# Altium schematic sheet 传感器板2.SchDoc
size A3
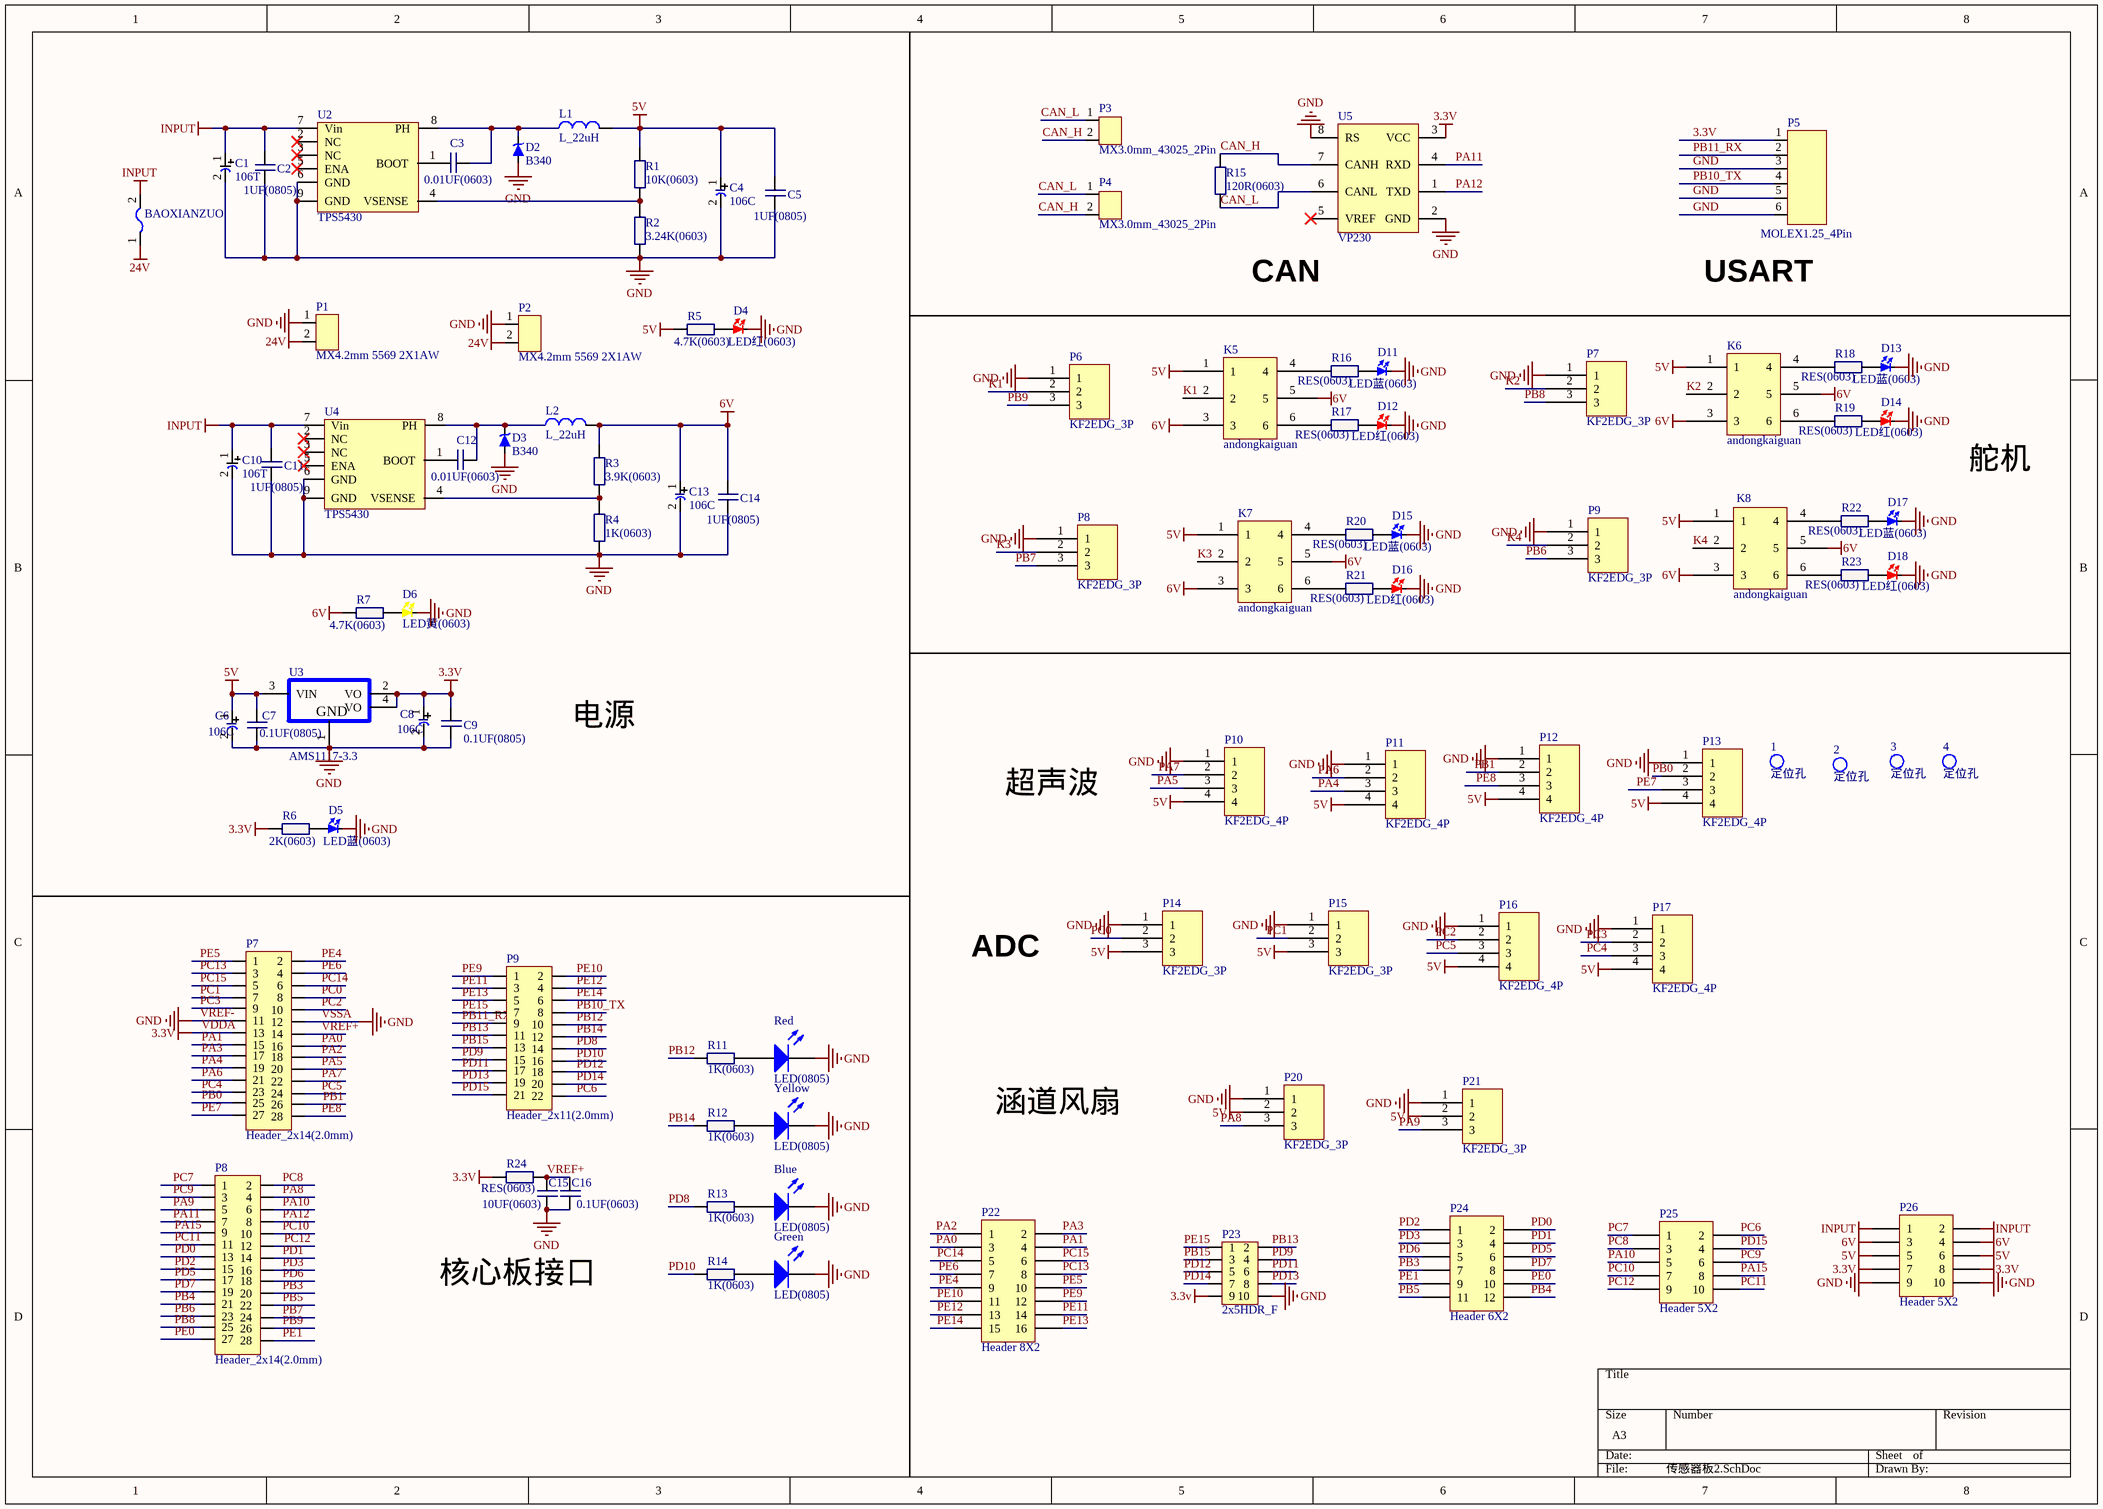
[diagram p0: 传感器板2.SchDoc]

## Parts
(Parts that share a designator on the sheet are numbered #1, #2 ... from top to bottom, then left to right.)
1  定位孔  [定位孔]
2  定位孔  [定位孔]
3  定位孔  [定位孔]
4  定位孔  [定位孔]
?  BAOXIANZUO  [BAOXIANZUO]
Blue  LED(0805)  [LED(0805)]
C1  106T  [TAN CAP]
C2  1UF(0805)  [CAP(0805)]
C3  0.01UF(0603)  [CAP(0603)]
C4  106C  [TAN106C]
C5  1UF(0805)  [CAP(0805)]
C6  106C  [TAN106C]
C7  0.1UF(0805)  [CAP(0805)]
C8  106C  [TAN106C]
C9  0.1UF(0805)  [CAP(0805)]
C10  106T  [TAN CAP]
C11  1UF(0805)  [CAP(0805)]
C12  0.01UF(0603)  [CAP(0603)]
C13  106C  [TAN106C]
C14  1UF(0805)  [CAP(0805)]
C15  10UF(0603)  [CAP(0603)]
C16  0.1UF(0603)  [CAP(0603)]
D2  B340  [B340]
D3  B340  [B340]
D4  LED红(0603)  [LED红(0603)]
D5  LED蓝(0603)  [LED蓝(0603)]
D6  LED黄(0603)  [LED黄(0603)]
D11  LED蓝(0603)  [LED蓝(0603)]
D12  LED红(0603)  [LED红(0603)]
D13  LED蓝(0603)  [LED蓝(0603)]
D14  LED红(0603)  [LED红(0603)]
D15  LED蓝(0603)  [LED蓝(0603)]
D16  LED红(0603)  [LED红(0603)]
D17  LED蓝(0603)  [LED蓝(0603)]
D18  LED红(0603)  [LED红(0603)]
Green  LED(0805)  [LED(0805)]
K5  andongkaiguan  [PCBComponent_1]
K6  andongkaiguan  [PCBComponent_1]
K7  andongkaiguan  [PCBComponent_1]
K8  andongkaiguan  [PCBComponent_1]
L1  L_22uH  [L_22uH]
L2  L_22uH  [L_22uH]
P1  MX4.2mm 5569 2X1AW  [MX4.2mm 5569 2X1AW]
P2  MX4.2mm 5569 2X1AW  [MX4.2mm 5569 2X1AW]
P3  MX3.0mm_43025_2Pin  [MX3.0mm_43025_2Pin]
P4  MX3.0mm_43025_2Pin  [MX3.0mm_43025_2Pin]
P5  MOLEX1.25_4Pin  [MOLEX1.25_4Pin]
P6  KF2EDG_3P  [PCBComponent_1]
P7#1  KF2EDG_3P  [PCBComponent_1]
P7#2  Header_2x14(2.0mm)  [Header_2x14(2.0mm)]
P8#1  KF2EDG_3P  [PCBComponent_1]
P8#2  Header_2x14(2.0mm)  [Header_2x14(2.0mm)]
P9#1  KF2EDG_3P  [PCBComponent_1]
P9#2  Header_2x11(2.0mm)  [Header_2x11(2.0mm)]
P10  KF2EDG_4P  [PCBComponent_1]
P11  KF2EDG_4P  [PCBComponent_1]
P12  KF2EDG_4P  [PCBComponent_1]
P13  KF2EDG_4P  [PCBComponent_1]
P14  KF2EDG_3P  [PCBComponent_1]
P15  KF2EDG_3P  [PCBComponent_1]
P16  KF2EDG_4P  [PCBComponent_1]
P17  KF2EDG_4P  [PCBComponent_1]
P20  KF2EDG_3P  [PCBComponent_1]
P21  KF2EDG_3P  [PCBComponent_1]
P22  Header 8X2  [HDR2X8]
P23  2x5HDR_F  [2x5HDR_F]
P24  Header 6X2  [HDR2X6]
P25  Header 5X2  [HDR2X5]
P26  Header 5X2  [HDR2X5]
R1  10K(0603)  [RES(0603)]
R2  3.24K(0603)  [RES(0603)]
R3  3.9K(0603)  [RES(0603)]
R4  1K(0603)  [RES(0603)]
R5  4.7K(0603)  [RES(0603)]
R6  2K(0603)  [RES(0603)]
R7  4.7K(0603)  [RES(0603)]
R11  1K(0603)  [RES(0603)]
R12  1K(0603)  [RES(0603)]
R13  1K(0603)  [RES(0603)]
R14  1K(0603)  [RES(0603)]
R15  120R(0603)  [RES(0603)]
R16  RES(0603)  [RES(0603)]
R17  RES(0603)  [RES(0603)]
R18  RES(0603)  [RES(0603)]
R19  RES(0603)  [RES(0603)]
R20  RES(0603)  [RES(0603)]
R21  RES(0603)  [RES(0603)]
R22  RES(0603)  [RES(0603)]
R23  RES(0603)  [RES(0603)]
R24  RES(0603)  [RES(0603)]
Red  LED(0805)  [LED(0805)]
U2  TPS5430  [TPS5430]
U3  AMS1117-3.3  [AMS1117-3.3]
U4  TPS5430  [TPS5430]
U5  VP230  [VP230]
Yellow  LED(0805)  [LED(0805)]

## Nets
3.3V: C8.1 C9.1 P5.1 P7#2.13 P23.9 P26.7 P26.8 R6.1 R24.1 U3.2(VO) U3.4(VO) U5.3(VCC)  [also labelled VDDA]
5V: C4.1 C5.1 C6.1 C7.1 K5.1 K6.1 K7.1 K8.1 L1.1 P10.4 P11.4 P12.4 P13.4 P14.3 P15.3 P16.4 P17.4 P20.2 P21.2 P26.5 P26.6 R1.2 R5.1 U3.3(VIN)
6V: C13.1 C14.1 K5.3 K5.5 K6.3 K6.5 K7.3 K7.5 K8.3 K8.5 L2.1 P26.3 P26.4 R3.2 R7.1
24V: ?.1 P1.2 P2.2
GND: Blue.1(K) C1.2 C2.2 C4.2 C5.2 C6.2 C7.2 C8.2 C9.2 C10.2 C11.2 C13.2 C14.2 C15.2 C16.2 D2.1(A) D3.1(A) D4.2 D5.2 D6.2 D11.2 D12.2 D13.2 D14.2 D15.2 D16.2 D17.2 D18.2 Green.1(K) P1.1 P2.1 P5.3 P5.5 P5.6 P6.1 P7#1.1 P7#2.11 P7#2.12 P8#1.1 P9#1.1 P10.1 P11.1 P12.1 P13.1 P14.1 P15.1 P16.1 P17.1 P20.1 P21.1 P23.10 P26.9 P26.10 R2.1 R4.1 Red.1(K) U2.6(GND) U2.9(GND) U3.1(GND) U4.6(GND) U4.9(GND) U5.2(GND) U5.8(RS) Yellow.1(K)  [also labelled VREF-, VSSA]
INPUT: ?.2 C1.1 C2.1 C10.1 C11.1 P26.1 P26.2 U2.7(Vin) U4.7(Vin)
CAN_H: P3.2 P4.2 R15.2 U5.7(CANH)
CAN_L: P3.1 P4.1 R15.1 U5.6(CANL)
K1: K5.2 P6.2
K2: K6.2 P7#1.2
K3: K7.2 P8#1.2
K4: K8.2 P9#1.2
PA0: P7#2.16 P22.3
PA1: P7#2.15 P22.4
PA2: P7#2.18 P22.1
PA3: P7#2.17 P22.2
PA4: P7#2.19 P11.3
PA5: P7#2.20 P10.3
PA6: P7#2.21 P11.2
PA7: P7#2.22 P10.2
PA8: P8#2.4 P20.3
PA9: P8#2.5 P21.3
PA10: P8#2.6 P25.5
PA11: P8#2.7 U5.4(RXD)
PA12: P8#2.8 U5.1(TXD)
PA15: P8#2.9 P25.8
PB0: P7#2.25 P13.2
PB1: P7#2.26 P12.2
PB3: P8#2.20 P24.7
PB4: P8#2.21 P24.12
PB5: P8#2.22 P24.11
PB6: P8#2.23 P9#1.3
PB7: P8#1.3 P8#2.24
PB8: P7#1.3 P8#2.25
PB9: P6.3 P8#2.26
PB10_TX: P5.4 P9#2.8
PB11_RX: P5.2 P9#2.9
PB12: P9#2.10 R11.1
PB13: P9#2.11 P23.2
PB14: P9#2.12 R12.1
PB15: P9#2.13 P23.3
PC0: P7#2.8 P14.2
PC1: P7#2.7 P15.2
PC2: P7#2.10 P16.2
PC3: P7#2.9 P17.2
PC4: P7#2.23 P17.3
PC5: P7#2.24 P16.3
PC6: P9#2.22 P25.2
PC7: P8#2.1 P25.1
PC8: P8#2.2 P25.3
PC9: P8#2.3 P25.6
PC10: P8#2.10 P25.7
PC11: P8#2.11 P25.10
PC12: P8#2.12 P25.9
PC13: P7#2.3 P22.8
PC14: P7#2.6 P22.5
PC15: P7#2.5 P22.6
PD0: P8#2.13 P24.2
PD1: P8#2.14 P24.4
PD2: P8#2.15 P24.1
PD3: P8#2.16 P24.3
PD5: P8#2.17 P24.6
PD6: P8#2.18 P24.5
PD7: P8#2.19 P24.8
PD8: P9#2.14 R13.1
PD9: P9#2.15 P23.4
PD10: P9#2.16 R14.1
PD11: P9#2.17 P23.6
PD12: P9#2.18 P23.5
PD13: P9#2.19 P23.8
PD14: P9#2.20 P23.7
PD15: P9#2.21 P25.4
PE0: P8#2.27 P24.10
PE1: P8#2.28 P24.9
PE4: P7#2.2 P22.9
PE5: P7#2.1 P22.10
PE6: P7#2.4 P22.7
PE7: P7#2.27 P13.3
PE8: P7#2.28 P12.3
PE9: P9#2.1 P22.12
PE10: P9#2.2 P22.11
PE11: P9#2.3 P22.14
PE12: P9#2.4 P22.13
PE13: P9#2.5 P22.16
PE14: P9#2.6 P22.15
PE15: P9#2.7 P23.1
VREF+: C15.1 C16.1 P7#2.14 R24.2
NetBlue_2: Blue.2(A) R13.2
NetC3_1: C3.1 U2.1(BOOT)
NetC3_2: C3.2 D2.2(K) L1.2 U2.8(PH)
NetC12_1: C12.1 U4.1(BOOT)
NetC12_2: C12.2 D3.2(K) L2.2 U4.8(PH)
NetD4_1: D4.1 R5.2
NetD5_1: D5.1 R6.2
NetD6_1: D6.1 R7.2
NetD11_1: D11.1 R16.2
NetD12_1: D12.1 R17.2
NetD13_1: D13.1 R18.2
NetD14_1: D14.1 R19.2
NetD15_1: D15.1 R20.2
NetD16_1: D16.1 R21.2
NetD17_1: D17.1 R22.2
NetD18_1: D18.1 R23.2
NetGreen_2: Green.2(A) R14.2
NetK5_4: K5.4 R16.1
NetK5_6: K5.6 R17.1
NetK6_4: K6.4 R18.1
NetK6_6: K6.6 R19.1
NetK7_4: K7.4 R20.1
NetK7_6: K7.6 R21.1
NetK8_4: K8.4 R22.1
NetK8_6: K8.6 R23.1
NetR1_1: R1.1 R2.2 U2.4(VSENSE)
NetR3_1: R3.1 R4.2 U4.4(VSENSE)
NetR11_2: R11.2 Red.2(A)
NetR12_2: R12.2 Yellow.2(A)

Not connected (* = marked no-connect by the designer): U2 2(NC)* 3(NC)* 5(ENA)*; U4 2(NC)* 3(NC)* 5(ENA)*; U5 5(VREF)*

## Notes on the sheet
- CAN
- (near P5) USART
- 舵机
- 电源
- 超声波
- ADC
- 涵道风扇
- 核心板接口

## Library data of the parts
C1 C10 = TAN CAP
C2 C5 C7 C9 C11 C14 = CAP(0805)
C3 C12 C15 C16 = CAP(0603)
C4 C6 C8 C13 = TAN106C
P22 = Header 8X2: Header, 8-Pin, Dual row; LatestRevisionDate: 17-Jul-2002; LatestRevisionNote: Re-released for DXP Platform.; Publisher: Altium Limited
P24 = Header 6X2: Header, 6-Pin, Dual row; LatestRevisionDate: 17-Jul-2002; LatestRevisionNote: Re-released for DXP Platform.; Publisher: Altium Limited
P25 P26 = Header 5X2: Header, 5-Pin, Dual row; LatestRevisionDate: 17-Jul-2002; LatestRevisionNote: Re-released for DXP Platform.; Publisher: Altium Limited
R1-R7 R11-R15 = RES(0603)